# Altium schematic sheet 05_DATA_IO.SchDoc
size A4
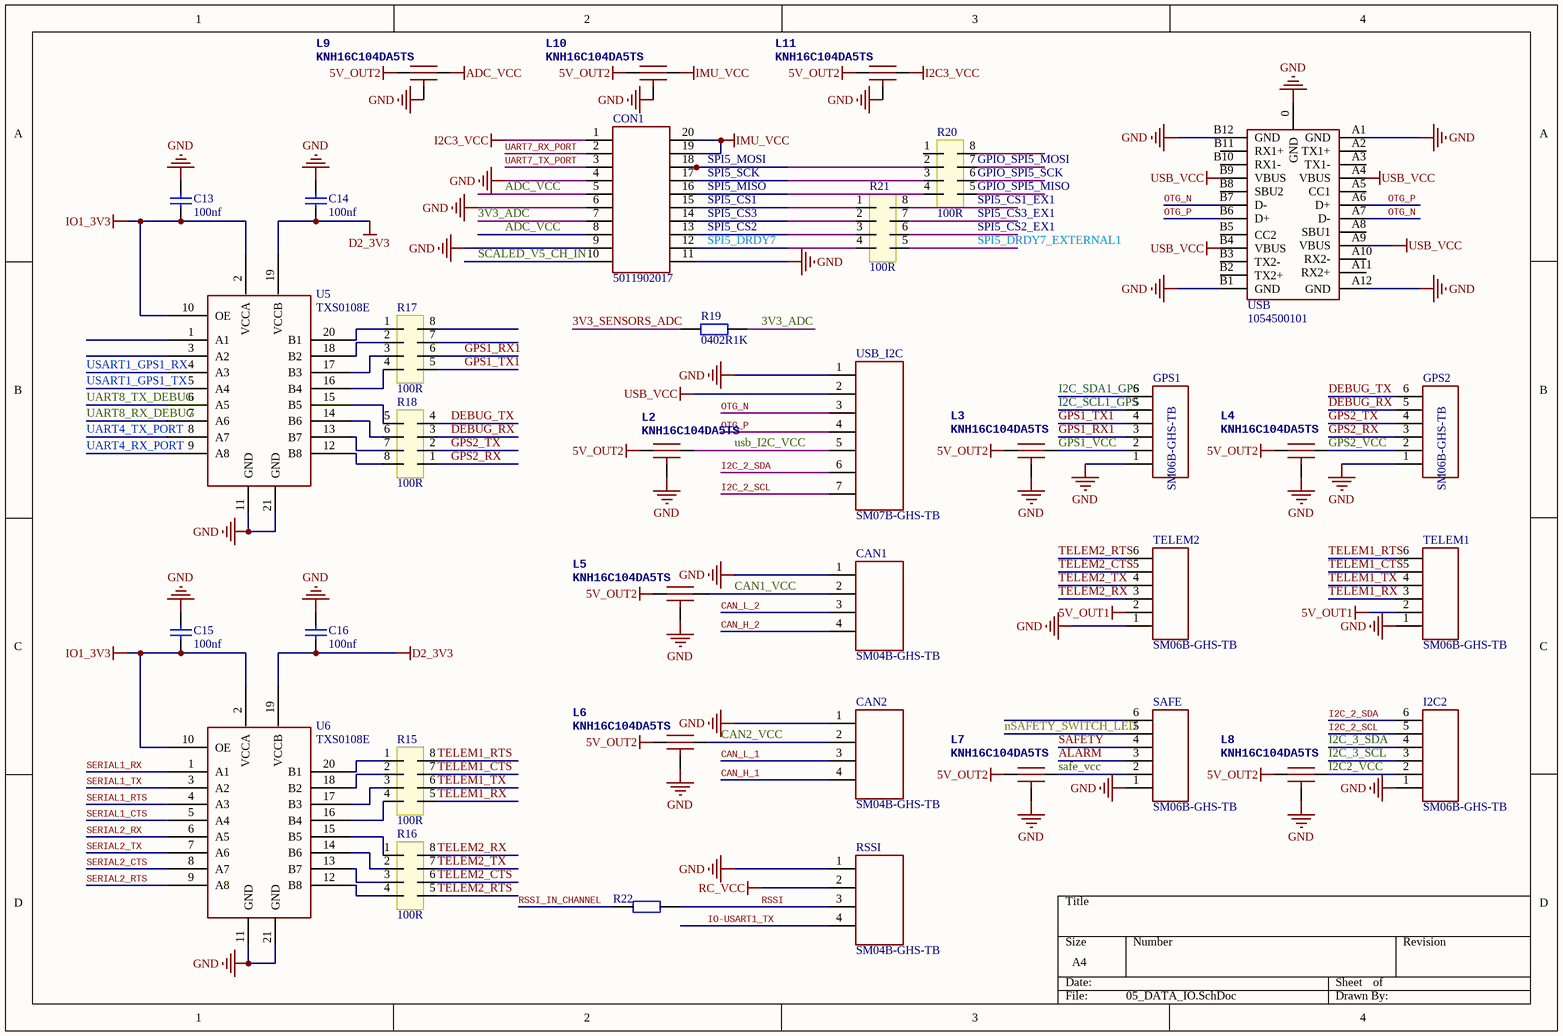
[diagram p0: 05_DATA_IO.SchDoc]

## Parts
C13  100nf  [0402CAP]
C14  100nf  [0402CAP]
C15  100nf  [0402CAP]
C16  100nf  [0402CAP]
CAN1  SM04B-GHS-TB  [BM04B-GHS]
CAN2  SM04B-GHS-TB  [BM04B-GHS]
CON1  5011902017  [5011902017]
GPS1  SM06B-GHS-TB  [SM06B-GHS-TB]
GPS2  SM06B-GHS-TB  [SM06B-GHS-TB]
I2C2  SM06B-GHS-TB  [SM06B-GHS-TB]
L2  KNH16C104DA5TS  [KYOCERA-KNH16-DA]
L3  KNH16C104DA5TS  [KYOCERA-KNH16-DA]
L4  KNH16C104DA5TS  [KYOCERA-KNH16-DA]
L5  KNH16C104DA5TS  [KYOCERA-KNH16-DA]
L6  KNH16C104DA5TS  [KYOCERA-KNH16-DA]
L7  KNH16C104DA5TS  [KYOCERA-KNH16-DA]
L8  KNH16C104DA5TS  [KYOCERA-KNH16-DA]
L9  KNH16C104DA5TS  [KYOCERA-KNH16-DA]
L10  KNH16C104DA5TS  [KYOCERA-KNH16-DA]
L11  KNH16C104DA5TS  [KYOCERA-KNH16-DA]
R15  100R  [0402_4r]
R16  100R  [0402_4r]
R17  100R  [0402_4r]
R18  100R  [0402_4r]
R19  0402R1K  [0402R]
R20  100R  [0402_4r]
R21  100R  [0402_4r]
R22  0402R100R  [0402R]  (value not drawn)
RSSI  SM04B-GHS-TB  [BM04B-GHS]
SAFE  SM06B-GHS-TB  [SM06B-GHS-TB]
TELEM1  SM06B-GHS-TB  [SM06B-GHS-TB]
TELEM2  SM06B-GHS-TB  [SM06B-GHS-TB]
U5  TXS0108E  [VQFN20]
U6  TXS0108E  [VQFN20]
USB  1054500101  [1054500101]
USB_I2C  SM07B-GHS-TB  [SM07B-GHS-TB]

## Nets
5V_OUT1: TELEM1.2 TELEM2.2
5V_OUT2: L2.P$1 L3.P$1 L4.P$1 L5.P$1 L6.P$1 L7.P$1 L8.P$1 L9.P$1 L10.P$1 L11.P$1
ADC_VCC: CON1.5 CON1.8 L9.P$2
D2_3V3: C14.2 C16.2 U5.19(VCCB) U6.19(VCCB)
GND: C13.1 C14.1 C15.1 C16.1 CAN1.1 CAN2.1 CON1.4 CON1.6 CON1.9 CON1.11 GPS1.1 GPS2.1 I2C2.1 L2.GND L3.GND L4.GND L5.GND L6.GND L7.GND L8.GND L9.GND L10.GND L11.GND RSSI.1 SAFE.1 TELEM1.1 TELEM2.1 U5.11(GND) U5.21(GND) U6.11(GND) U6.21(GND) USB.0(GND) USB.A1(GND) USB.A12(GND) USB.B1(GND) USB.B12(GND) USB_I2C.1
I2C3_VCC: CON1.1 L11.P$2
IMU_VCC: CON1.19 CON1.20 L10.P$2
IO1_3V3: C13.2 C15.2 U5.2(VCCA) U5.10(OE) U6.2(VCCA) U6.10(OE)
RC_VCC: RSSI.2
USB_VCC: USB.A4(VBUS) USB.A9(VBUS) USB.B4(VBUS) USB.B9(VBUS) USB_I2C.2
3V3_ADC: CON1.7 R19.2
3V3_SENSORS_ADC: R19.1
ALARM: SAFE.3
CAN1_VCC: CAN1.2 L5.P$2
CAN2_VCC: CAN2.2 L6.P$2
CAN_H_1: CAN2.4
CAN_H_2: CAN1.4
CAN_L_1: CAN2.3
CAN_L_2: CAN1.3
DEBUG_RX: GPS2.5 R18.3
DEBUG_TX: GPS2.6 R18.4
GPIO_SPI5_MISO: R20.5
GPIO_SPI5_MOSI: R20.7
GPIO_SPI5_SCK: R20.6
GPS1_RX1: GPS1.3 R17.6
GPS1_TX1: GPS1.4 R17.5
GPS1_VCC: GPS1.2 L3.P$2
GPS2_RX: GPS2.3 R18.1
GPS2_TX: GPS2.4 R18.2
GPS2_VCC: GPS2.2 L4.P$2
I2C2_VCC: I2C2.2 L8.P$2
I2C_2_SCL: I2C2.5 USB_I2C.7
I2C_2_SDA: I2C2.6 USB_I2C.6
I2C_3_SCL: I2C2.3
I2C_3_SDA: I2C2.4
I2C_SCL1_GPS: GPS1.5
I2C_SDA1_GPS: GPS1.6
IO-USART1_TX: RSSI.4
nSAFETY_SWITCH_LED: SAFE.5
OTG_N: USB.A7(D-) USB.B7(D-) USB_I2C.3
OTG_P: USB.A6(D+) USB.B6(D+) USB_I2C.4
RSSI: R22.2 RSSI.3
RSSI_IN_CHANNEL: R22.1
safe_vcc: L7.P$2 SAFE.2
SAFETY: SAFE.4
SCALED_V5_CH_IN: CON1.10
SERIAL1_CTS: U6.5(A4)
SERIAL1_RTS: U6.4(A3)
SERIAL1_RX: U6.1(A1)
SERIAL1_TX: U6.3(A2)
SERIAL2_CTS: U6.8(A7)
SERIAL2_RTS: U6.9(A8)
SERIAL2_RX: U6.6(A5)
SERIAL2_TX: U6.7(A6)
SPI5_CS1: CON1.15 R21.1
SPI5_CS1_EX1: R21.8
SPI5_CS2: CON1.13 R21.3
SPI5_CS2_EX1: R21.6
SPI5_CS3: CON1.14 R21.2
SPI5_CS3_EX1: R21.7
SPI5_DRDY7: CON1.12 R21.4
SPI5_DRDY7_EXTERNAL1: R21.5
SPI5_MISO: CON1.16 R20.4
SPI5_MOSI: CON1.18 R20.2
SPI5_SCK: CON1.17 R20.3
TELEM1_CTS: R15.7 TELEM1.5
TELEM1_RTS: R15.8 TELEM1.6
TELEM1_RX: R15.5 TELEM1.3
TELEM1_TX: R15.6 TELEM1.4
TELEM2_CTS: R16.6 TELEM2.5
TELEM2_RTS: R16.5 TELEM2.6
TELEM2_RX: R16.8 TELEM2.3
TELEM2_TX: R16.7 TELEM2.4
UART4_RX_PORT: U5.9(A8)
UART4_TX_PORT: U5.8(A7)
UART7_RX_PORT: CON1.2
UART7_TX_PORT: CON1.3
UART8_RX_DEBUG: U5.7(A6)
UART8_TX_DEBUG: U5.6(A5)
USART1_GPS1_RX: U5.4(A3)
USART1_GPS1_TX: U5.5(A4)
usb_I2C_VCC: L2.P$2 USB_I2C.5
NetR15_1: R15.1 U6.20(B1)
NetR15_2: R15.2 U6.18(B2)
NetR15_3: R15.3 U6.17(B3)
NetR15_4: R15.4 U6.16(B4)
NetR16_1: R16.1 U6.15(B5)
NetR16_2: R16.2 U6.14(B6)
NetR16_3: R16.3 U6.13(B7)
NetR16_4: R16.4 U6.12(B8)
NetR17_1: R17.1 U5.20(B1)
NetR17_2: R17.2 U5.18(B2)
NetR17_3: R17.3 U5.17(B3)
NetR17_4: R17.4 U5.16(B4)
NetR18_5: R18.5 U5.15(B5)
NetR18_6: R18.6 U5.14(B6)
NetR18_7: R18.7 U5.13(B7)
NetR18_8: R18.8 U5.12(B8)

Not connected (* = marked no-connect by the designer): R17 7 8; R20 1 8; SAFE 6; U5 1(A1) 3(A2); USB A2(TX1+) A3(TX1-) A5(CC1) A8(SBU1) A10(RX2-) A11(RX2+) B2(TX2+) B3(TX2-) B5(CC2) B8(SBU2) B10(RX1-) B11(RX1+)

## Library data of the parts
C13-C16 = Cap
L2-L11 = KNH16C104DA5TS: Capacitor, Filter, 0.1uF, 25V, 2A, 0603, SMD; 3DR_PARTNO: ECM0719; Supplier 1: Digi-Key
R15-R18 R20 R21 = 0402-8R-4R
R19 = 0402R1K: 0402R1K 1%
R22 = 0402R100R: 0402R100R 1%